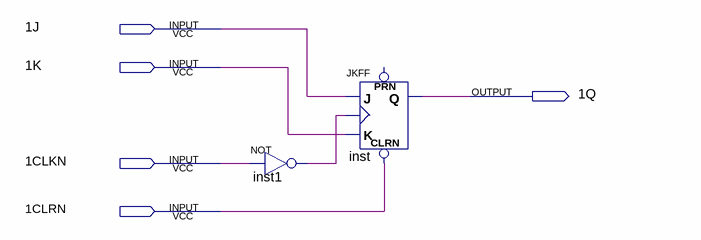
[diagram p0: schematic sheet]
// Quartus schematic NJKKFF.bdf as structural Verilog: 2 symbols, 5 pins
module NJKKFF (
  input  \1J ,
  input  \1K ,
  input  \1CLKN ,
  input  \1CLRN ,
  output \1Q 
);

  wire inst1_out;

  not inst1 (inst1_out, \1CLKN );
  JKFF inst (.CLRN(\1CLRN ), .K(\1K ), .J(\1J ), .CLK(inst1_out), .Q(\1Q ));  // open: PRN
endmodule
